# Altium schematic sheet S3C_SupplyAndMonitoring.SchDoc
size A4; Organization: UltraZohm; SheetNumber: 24
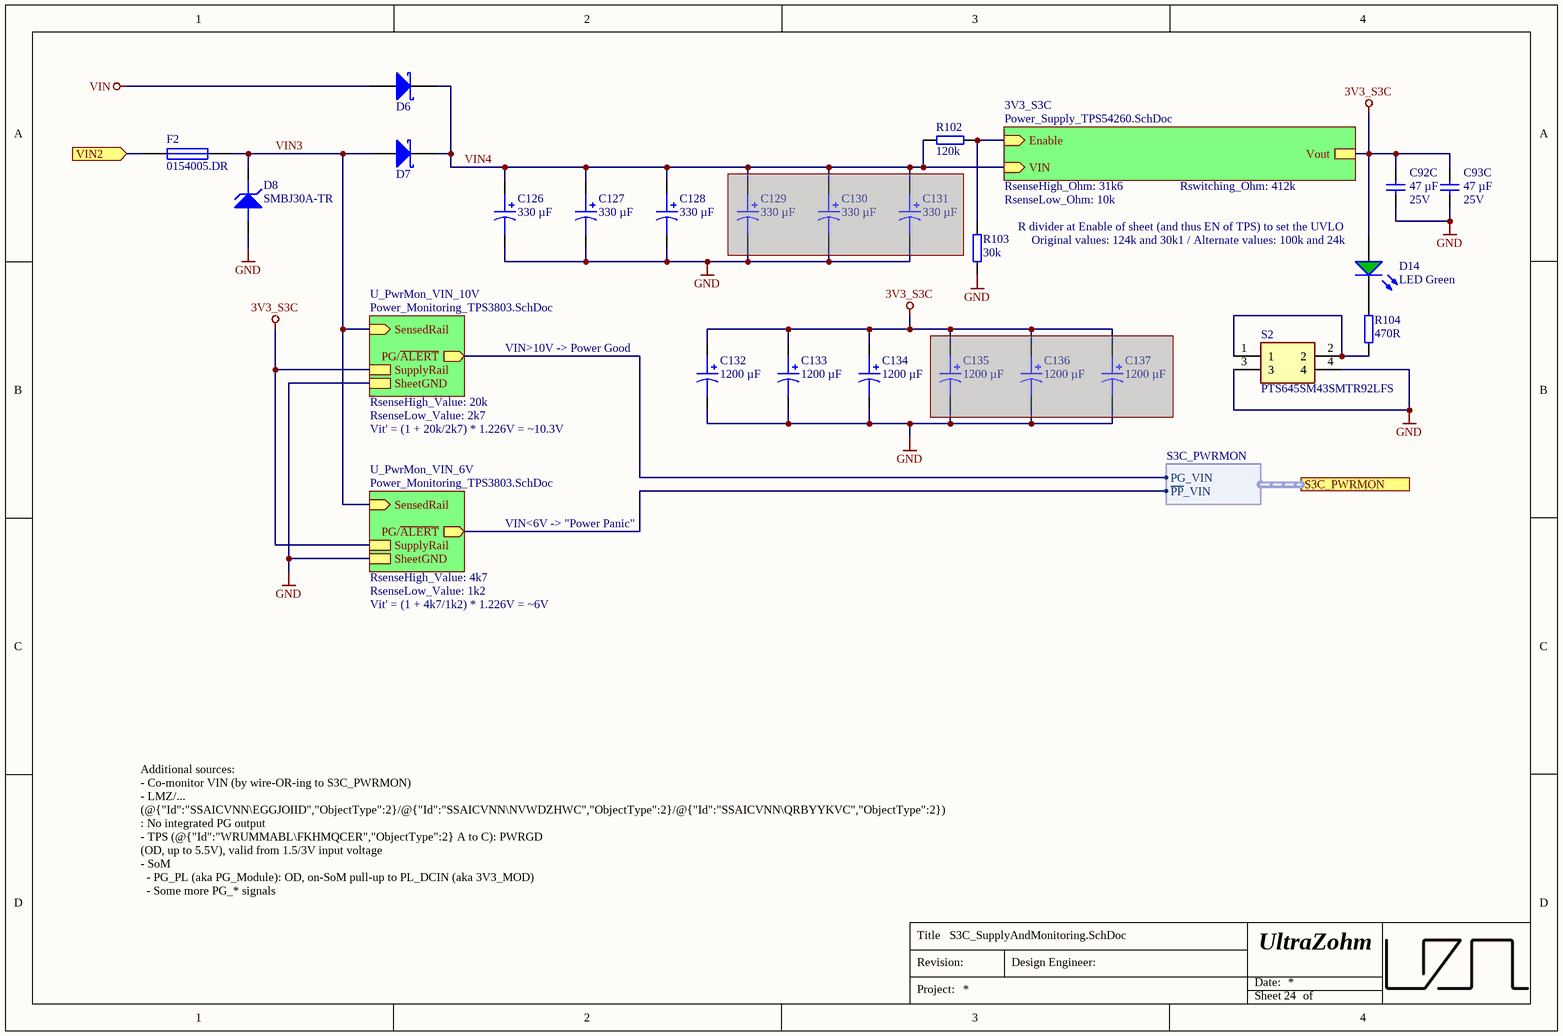
[diagram p0: S3C_SupplyAndMonitoring.SchDoc]

## Parts
C92C  47 µF  Voltage: 25V  [C_1206_TE]
C93C  47 µF  Voltage: 25V  [C_1206_TE]
C126  330 µF  [CAPAE1050X1250N]
C127  330 µF  [CAPAE1050X1250N]
C128  330 µF  [CAPAE1050X1250N]
C129  330 µF  [CAPAE1050X1250N]  (masked out: inside a compile mask, not in the netlist)
C130  330 µF  [CAPAE1050X1250N]  (masked out: inside a compile mask, not in the netlist)
C131  330 µF  [CAPAE1050X1250N]  (masked out: inside a compile mask, not in the netlist)
C132  1200 µF  [CAPAE1050X1250N]
C133  1200 µF  [CAPAE1050X1250N]
C134  1200 µF  [CAPAE1050X1250N]
C135  1200 µF  [CAPAE1050X1250N]  (masked out: inside a compile mask, not in the netlist)
C136  1200 µF  [CAPAE1050X1250N]  (masked out: inside a compile mask, not in the netlist)
C137  1200 µF  [CAPAE1050X1250N]  (masked out: inside a compile mask, not in the netlist)
D6  40V  [DIOM5226X262N]  (value not drawn)
D7  40V  [DIOM5226X262N]  (value not drawn)
D8  SMBJ30A-TR  [DIOM5436X244N]
D14  LED Green  [WL-SMCW_0603]
F2  0154005.DR  [Littlefuse_154]
R102  120k  [R_0603_TE]
R103  30k  [R_0603_TE]
R104  470R  [R_0603_TE]
S2  PTS645SM43SMTR92LFS  [PTS645_SMT]

## Sub-sheets
3V3_S3C = Power_Supply_TPS54260.SchDoc: Vout, Enable (in), VIN (in)  | RsenseHigh_Ohm: 31k6; RsenseLow_Ohm: 10k; Rswitching_Ohm: 412k; SubSheet_SheetNumber: 25; Output_V: 3.3
U_PwrMon_VIN_6V = Power_Monitoring_TPS3803.SchDoc: SensedRail (in), PG/~{ALERT} (out), SupplyRail, SheetGND  | RsenseHigh_Value: 4k7; RsenseLow_Value: 1k2; SubSheet_SheetNumber: 26.1
U_PwrMon_VIN_10V = Power_Monitoring_TPS3803.SchDoc: SensedRail (in), PG/~{ALERT} (out), SupplyRail, SheetGND  | RsenseHigh_Value: 20k; RsenseLow_Value: 2k7; SubSheet_SheetNumber: 26.2

## Ports
S3C_PWRMON (harness S3C_PWRMON), VIN2 (in)

## Harnesses
S3C_PWRMON: PG_VIN, ~{PP}_VIN

## Nets
3V3_S3C: C92C.2 C93C.2 C132.1 C133.1 C134.1 D14.2(A) ; sheet 3V3_S3C/Vout, sheet U_PwrMon_VIN_10V/SupplyRail, sheet U_PwrMon_VIN_6V/SupplyRail
GND: C92C.1 C93C.1 C126.2 C127.2 C128.2 C132.2 C133.2 C134.2 D8.2(ANODE) R103.1 S2.3 S2.4 ; sheet U_PwrMon_VIN_10V/SheetGND, sheet U_PwrMon_VIN_6V/SheetGND
VIN: D6.2(A)
VIN2: F2.1 ; port VIN2
VIN3: D7.2(A) D8.1(KATHODE) F2.2 ; sheet U_PwrMon_VIN_10V/SensedRail, sheet U_PwrMon_VIN_6V/SensedRail
VIN4: C126.1 C127.1 C128.1 D6.1(K) D7.1(K) R102.1 ; sheet 3V3_S3C/VIN
NetD14_1: D14.1(K) R104.2
NetR102_2: R102.2 R103.2 ; sheet 3V3_S3C/Enable
NetR104_1: R104.1 S2.1 S2.2
(unnamed): sheet U_PwrMon_VIN_10V/PG/~{ALERT}, port S3C_PWRMON.PG_VIN
(unnamed): sheet U_PwrMon_VIN_6V/PG/~{ALERT}, port S3C_PWRMON.~{PP}_VIN

## Notes on the sheet
- R divider at Enable of sheet (and thus EN of TPS) to set the UVLO
- (near D14) Original values: 124k and 30k1 / Alternate values: 100k and 24k
- VIN>10V -> Power Good
- Vit' = (1 + 20k/2k7) * 1.226V = ~10.3V
- VIN<6V -> "Power Panic"
- Vit' = (1 + 4k7/1k2) * 1.226V = ~6V
- Additional sources:
  - Co-monitor VIN (by wire-OR-ing to S3C_PWRMON)
  - LMZ/... (@{"Id":"SSAICVNN\EGGJOIID","ObjectType":2}/@{"Id":"SSAICVNN\NVWDZHWC","ObjectType":2}/@{"Id":"SSAICVNN\QRBYYKVC","ObjectType":2}) : No integrated PG output
  - TPS (@{"Id":"WRUMMABL\FKHMQCER","ObjectType":2} A to C): PWRGD (OD, up to 5.5V), valid from 1.5/3V input voltage
  - SoM
  - PG_PL (aka PG_Module): OD, on-SoM pull-up to PL_DCIN (aka 3V3_MOD)
  - Some more PG_* signals
  - PLL_LOLn
- Title
- Revision:
- Design Engineer:
- Date:
- Project:
- Sheet
- of

## Library data of the parts
C92C C93C = UZgen_C_1206_47uF_25V_X7R: Generic capacitor; Manufacturer: UZgen; Tolerance: 10 %; Created from: MGeier; Value: 47 µF; Technology: X7R; Manufacturer Part Number: UZgen_C_1206_47uF_25V_X7R; PartID: 5224; Created On: 02/08/2024 11:18:30; Device Package: 1206; Mounting Type: SMD; Last Updated: 02/08/2024 15:18:55
C126-C131 = EEEFT1H331GP: Aluminium Electrolytic Capacitors - SMD 330uF 50V; Manufacturer: Panasonic; Tolerance: 20 %; Voltage Rating: 50 VDC; Created from: FRosner; Manufacturer Part Number: EEEFT1H331GP; PartID: 163; Created On: 05/09/2024 09:08:02; ComponentLink1Description: Datasheet; ComponentLink1URL: https://www.mouser.de/datasheet/2/315/ABA0000C1240-1130326.pdf; Component Type: Aluminium Electrolytic; Device Package: 10 mm; Last Updated: 05/10/2024 13:28:45; Mounting Type: SMD; Operating Temperature: -55 to +105°C; Series: FT; Supplier 1: Mouser; Supplier Part Number 1: 667-EEE-FT1H331GP; Supplier 2: LCSC; Supplier Part Number 2: C542207; Type: Capacitor; Value: 330 µF; Live Cycle Status: 1; LCSC Part Number: C542207
C132-C137 = EEE-FPA122UAP: Aluminium Electrolytic Capacitors - SMD 1200uF 10V; Manufacturer: Panasonic; Tolerance: 20 %; Voltage Rating: 10 VDC; Created from: FRosner; Manufacturer Part Number: EEE-FPA122UAP; PartID: 162; Created On: 05/09/2024 09:12:47; ComponentLink1Description: Datasheet; ComponentLink1URL: https://www.mouser.de/datasheet/2/315/ABA0000C1184-947404.pdf; Component Type: Aluminium Electrolytic; Device Package: 10 mm; Last Updated: 05/10/2024 13:28:46; Mounting Type: SMD; Operating Temperature: -55 to +105°C; Series: FP; Supplier 1: Mouser; Supplier Part Number 1: 667-EEE-FPA122UAP; Supplier 2: LCSC; Supplier Part Number 2: C401755; Type: Capacitor; Value: 1200 µF; Live Cycle Status: 1; LCSC Part Number: C401755
D6 D7 = SS14: Schottky Diode, 40 V, 1 A; MPN: BYS12-90-E3/TR3; Manufacturer Part Number: SS14; Manufacturer: onsemi; MF: Vishay; Forward Voltage: 0.5 V; Reverse Voltage: 90V; Rated Current: 1.5A; Forward Current: 1 A; Reverse Current: 10 mA; Created from: MGeier; Package: DO-214AC; Supplier 1: LCSC; Supplier 2: Mouser; Supplier 3: Digi-Key; Supplier Part Number 1: C83852; Supplier Part Number 2: 625-BYS12-90-E3/TR3; Supplier Part Number 3: BYS12-90-E3/GICT-ND; PartID: 14; Created On: 05/04/2024 16:08:36; ComponentLink1Description: Datasheet; ComponentLink1URL: https://wmsc.lcsc.com/wmsc/upload/file/pdf/v2/lcsc/1809291420_onsemi-SS14_C83852.pdf; Component Type: Schottky Diode; Device Package: SMA (DO-214AC); Last Updated: 22/08/2024 08:31:16; Mounting Type: SMD; Operating Temperature: -65 to +125 °C; Type: Schottky Diode; Value: 40V; Live Cycle Status: 1; LCSC Part Number: C83852; Stock number: not stored
D8 = SMBJ30A-TR: TVS Diode 30V 600W SMB unidirectional / ESD suppressor; Manufacturer: STMicroelectronics; Type: TVS-Diode; Created from: PBaumann; Manufacturer Part Number: SMBJ30A-TR; PartID: 19; Created On: 05/03/2021 11:12:07; ComponentLink1Description: Datasheet; ComponentLink1URL: https://www.st.com/resource/en/datasheet/smbj30a.pdf; Component Type: TVS Diode; Device Package: DO-214AA-2; Last Updated: 23/07/2025 19:13:45; Mounting Type: SMD; Operating Temperature: -55 - 150°C; Series: SMBJxxA; Supplier 1: LCSC; Supplier Part Number 1: C133663; Value: 30V; Live Cycle Status: 1; LCSC Part Number: C133663
D14 = UZgen_LED_0603_Green: Standard LEDs - SMD 0603 green; Manufacturer: UZgen; Created from: UZgenTool; Manufacturer Part Number: UZgen_LED_0603_Green; PartID: 21; Created On: 09/09/2024 10:45:01; ComponentLink1Description: N/A; ComponentLink1URL: N/A; Component Type: LED Diode; Device Package: 0603; Last Updated: 09/09/2024 10:45:01; Mounting Type: SMD; Supplier 1: LCSC; Supplier Part Number 1: =LCSC Part Number; Type: Standard; Value: LED Green; Live Cycle Status: 1; Stock number: not stored; Color: green
F2 = 0154005.DR: Fuse OMNI BLOK 154; Manufacturer: Littlefuse; Nominal current: 5 A; Nominal voltage AC: 125 VAC; Nominal voltage DC: 125 VDC; Resistance: 12.5 mOhm; Value: 5 A; Created from: MGremer; Manufacturer Part Number: 0154005.DR; PartID: 1; Created On: 07/01/2021 10:17:19; ComponentLink1Description: Datasheet; ComponentLink1URL: https://www.mouser.de/datasheet/2/240/Littelfuse_Fuse_154_154T_154L_154TL_Datasheet_pdf-365375.pdf; Component Type: NAN02 - 154 OMNI-BLOK; Device Package: OMNI-BLOK; Last Updated: 04/09/2024 15:44:00; Mounting Type: SMD; Operating Temperature: -55 - 125 °C; Series: 154; Supplier 1: Mouser; Supplier Part Number 1: 576-0154005.DR; Type: Fuse; Live Cycle Status: 1; Supplier 2: LCSC; Supplier Part Number 2: C206916; LCSC Part Number: C206916
R102 = UZgen_R_0603_120k: Generic resistor; Manufacturer: UZgen; Tolerance: 1 %; Created from: UZgenTool; Manufacturer Part Number: UZgen_R_0603_120k; PartID: 270; Created On: 02/07/2024 17:29:50; Value: 120k; Device Package: 0603; Mounting Type: SMD; Last Updated: 02/07/2024 17:29:50
R103 = UZgen_R_0603_30k: Generic resistor; Manufacturer: UZgen; Tolerance: 1 %; Created from: UZgenTool; Manufacturer Part Number: UZgen_R_0603_30k; PartID: 255; Created On: 02/07/2024 17:29:50; Value: 30k; Device Package: 0603; Mounting Type: SMD; Last Updated: 02/07/2024 17:29:50
R104 = UZgen_R_0603_470R: Generic resistor; Manufacturer: UZgen; Tolerance: 1 %; Created from: UZgenTool; Manufacturer Part Number: UZgen_R_0603_470R; PartID: 213; Created On: 02/07/2024 17:29:49; Value: 470R; Device Package: 0603; Mounting Type: SMD; Last Updated: 02/07/2024 17:29:49
S2 = PTS645SM43SMTR92LFS: 50mA SPST 160gf 12V SMD-4P,6x6mm Tactile Switches ROHS; Manufacturer_Name: C & K COMPONENTS; Manufacturer: C&K COMPONENTS; Value: Push Button; Created from: AGeiger; Datasheet Link: https://www.ckswitches.com/media/1471/pts645.pdf; Manufacturer_Part_Number: PTS645SM43SMTR92LFS; Mouser Part Number: 611-PTS645SM43SMTR92; Mouser Price/Stock: https://www.mouser.co.uk/ProductDetail/CK/PTS645SM43SMTR92LFS?qs=FESYatJ8odKPktxv6ncfWg%3D%3D; Arrow Part Number: PTS645SM43SMTR92LFS; Arrow Price/Stock: https://www.arrow.com/en/products/pts645sm43smtr92lfs/ck; Manufacturer Part Number: PTS645SM43SMTR92LFS; PartID: 24; Created On: 31/05/2023 15:31:02; ComponentLink1Description: Datasheet; ComponentLink1URL: https://datasheet.lcsc.com/lcsc/1810121628_C-K-PTS645SM43SMTR92LFS_C221880.pdf; Component Type: Tactile Switch; Device Package: SMD; Last Updated: 31/05/2023 15:31:02; Mounting Type: SMD; Operating Temperature: -20 to +60 °C; Supplier 1: Mouser; Supplier Part Number 1: 611-PTS645SM43SMTR92; Supplier 2: LCSC; Supplier Part Number 2: C221880; Type: Tactile Switch; Live Cycle Status: 1; LCSC Part Number: C221880